# EAGLE design acs712 (EAGLE 5.10)
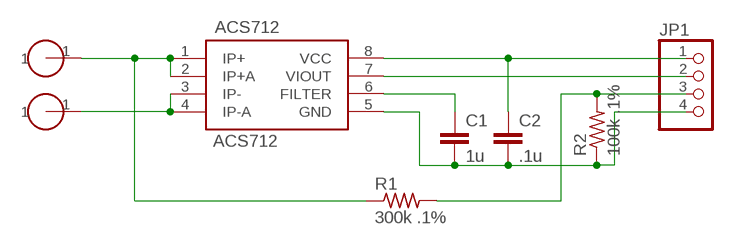
[diagram p0: schematic, sheet 1]

## Parts
ACS712  ACS712  [SOICC]
C1  1u  C-EUC0603  [C0603]
C2  .1u  C-EUC0603  [C0603]
JP1  PINHD-1X4  [1X04]
R1  300k .1%  R-US_R0603  [R0603]
R2  100k .1%  R-US_R0603  [R0603]
U$2  SCREW  [SCREW10]
U$3  SCREW  [SCREW10]

## Nets
GND: ACS712.5(GND) C1.2 C2.2 JP1.4 R2.1
IP+: ACS712.1(IP+) ACS712.2(IP+A) R1.1 U$2.1
IP-: ACS712.3(IP-) ACS712.4(IP-A) U$3.1
N$2: ACS712.7(VIOUT) JP1.2
N$6: ACS712.6(FILTER) C1.1
N$7: JP1.3 R1.2 R2.2
VCC: ACS712.8(VCC) C2.1 JP1.1

## Library data of the parts
ACS712 = lee:ACS712
C1 C2 = resistor:C-EU: CAPACITOR, European symbol
JP1 = pinhead:PINHD-1X4: PIN HEADER
R1 R2 = resistor:R-US_: RESISTOR, American symbol
U$2 U$3 = lee:SCREW

## Board
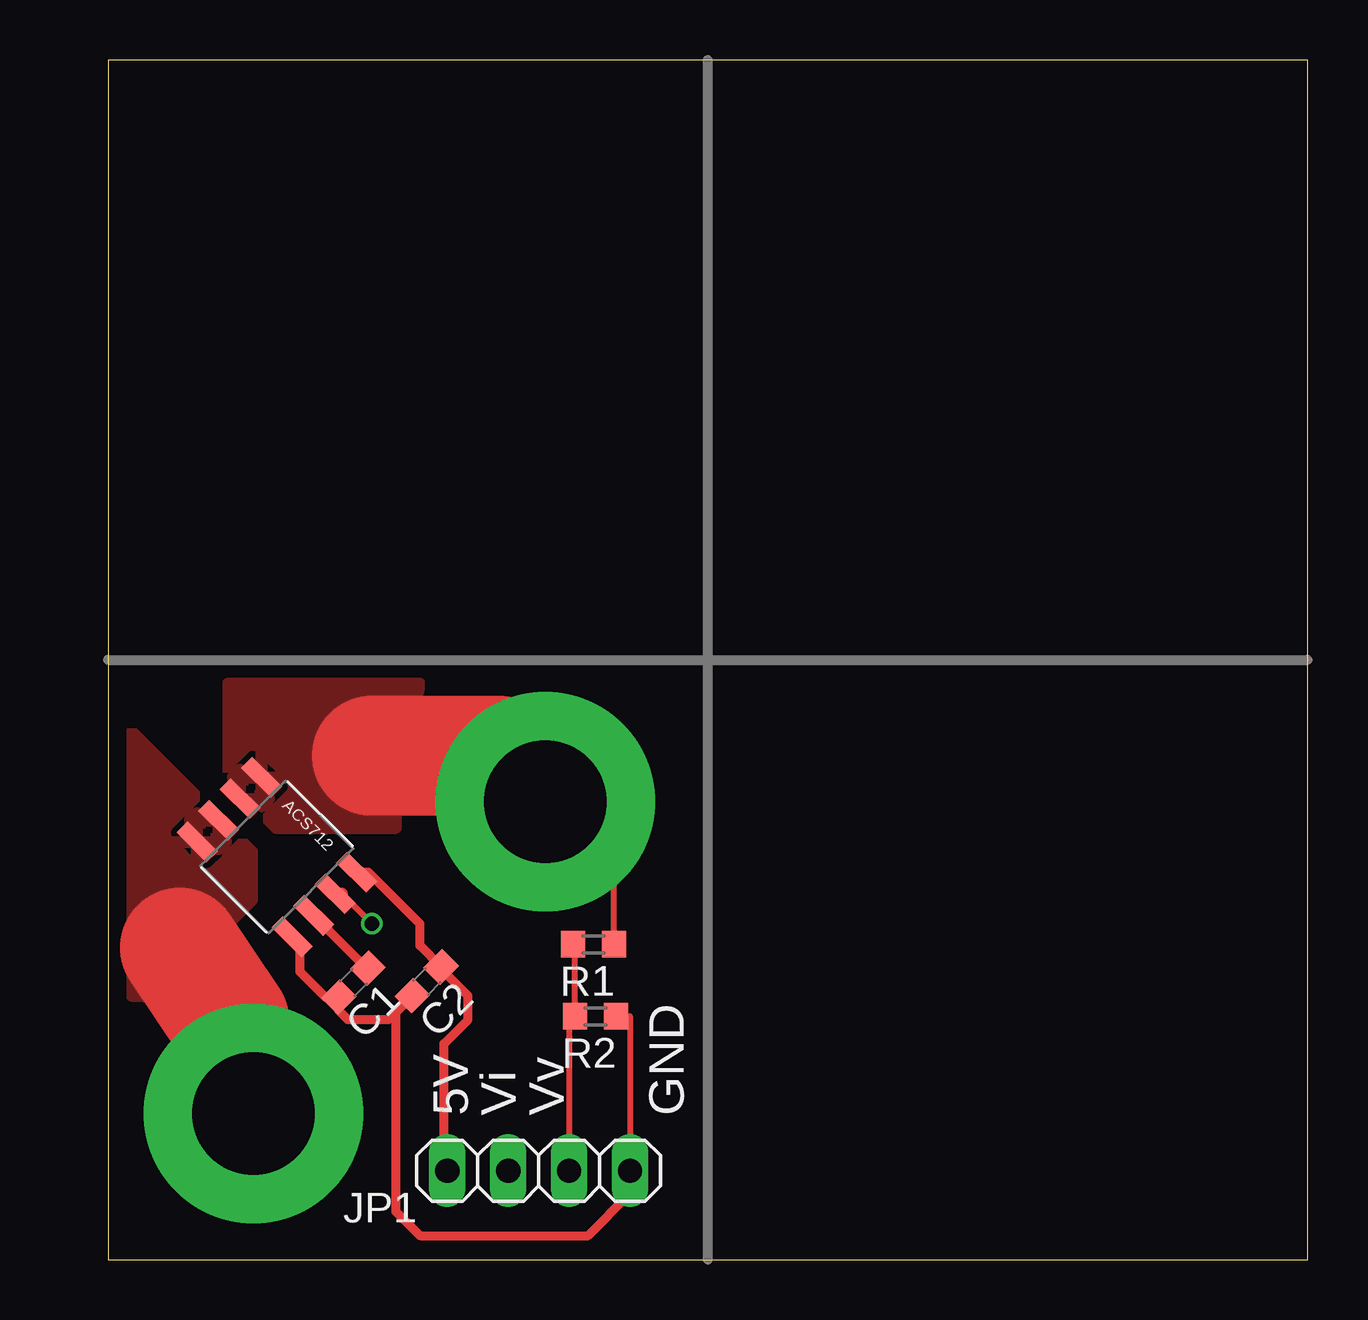
[diagram p1: board, top side]
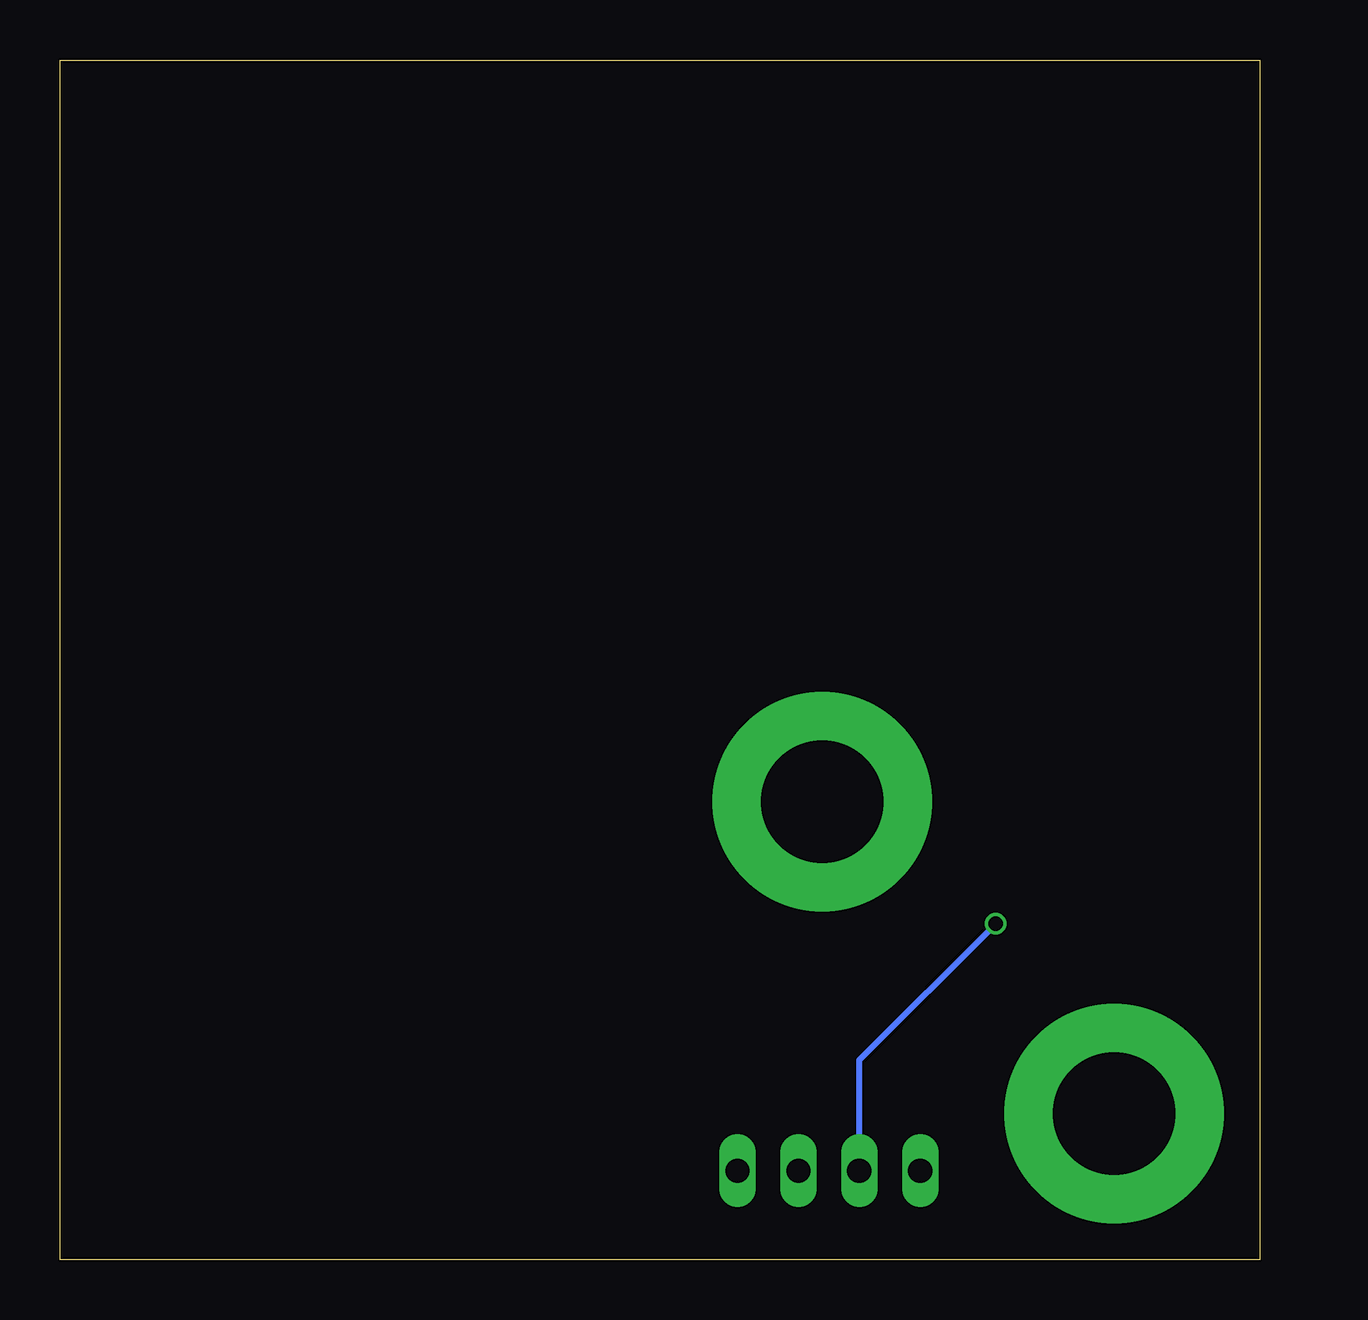
[diagram p2: board, bottom side, seen from below]

Size 50 x 50 mm. Coordinates in mm from the lower left corner, seen from the top.
Outline: 0,0 50,0 50,50 0,50 0,0
Copper layers (1*16): Top 0.035mm / dielectric 1.5mm / Bottom 0.035mm
Design rules "Fusion_eagle_rule_v1.1": minimum track width 6mil, minimum drill 12mil, track to track 6mil, track to pad 6mil, pad to pad 6mil, via to via 6mil, smd to smd 0mil, copper to edge 10mil, drill to drill 10mil, minimum pad ring 10mil, minimum via ring 6mil, stop-mask expansion 2mil, vias tented up to drill 100mil, thermal gap 10mil

### Footprints (pad centres in the part's own frame; a part is rotated, then mirrored left to right if it is on the bottom)
SOICC = smd 1.75 x 0.65: 1 -2.8,1.9; 2 -2.8,0.63; 3 -2.8,-0.64; 4 -2.8,-1.91; 5 2.8,-1.91; 6 2.8,-0.64; 7 2.8,0.63; 8 2.8,1.9
C0603 = smd 1.1 x 1: 1 -0.85,0; 2 0.85,0
1X04 = drill 1.016 long: 1 -3.81,0; 2 -1.27,0; 3 1.27,0; 4 3.81,0
R0603 = smd 1 x 1.1: 1 -0.85,0; 2 0.85,0
SCREW10 = drill 5.105 pad 9.144 round: 1 0,0

### Placement (x,y rotation side)
ACS712  7.04,16.78 315 top
C1  10.23,11.54 225 top
C2  13.29,11.6 225 top
JP1  17.95,3.7 0 top
R1  20.24,13.14 180 top
R2  20.32,10.14 180 top
U$2  18.22,19.08 0 top
U$3  6.06,6.08 0 top

### Tracks (layer width: path | path; a pad name or v marks a point on that pad's centre or on a via)
GND
  Top 0.254: R2.1 21.76,10.14 JP1.4
  Top 0.381: ACS712.5 8,13.12 8,12 9.06,10.94 C1.2 9.63,10.37 10,10 11.69,10 C2.2 12,10.31 12,2 13,1 20,1 21.76,2.76 JP1.4
IP+
  Top 0.254: R1.1 21.09,16.21 U$2.1
  Top 5: U$2.1 16.3,21 11,21
  pour Top: 13,24 5,24 5,20 7,18 12,18 12,20
IP-
  Top 5: U$3.1 5.06,9.94 3,13
  pour Top (isolate 0.254): 4,19 1,22 1,11 2,11 6,15 6,17
N$2  (via drill 0.6)
  Top 0.254: v11,14 9.75,15.25
  Top 0.5: 9.75,15.25 ACS712.7
  Bottom 0.254: v11,14 16.68,8.32 JP1.2
N$6
  Top 0.381: C1.1 10.78,12.14 ACS712.6
N$7
  Top 0.254: R1.2 19.47,13.14 R2.2 19.22,10.14 JP1.3
VCC
  Top 0.381: JP1.1 14,3.84 14,9 15,10 15,11 13.89,12.11 C2.1 13,13.09 13,14 10.86,16.14 ACS712.8

### Text on the board
tPlace: 5V | Vi | Vv | GND